# Altium project USB2TTL.PrjPCB
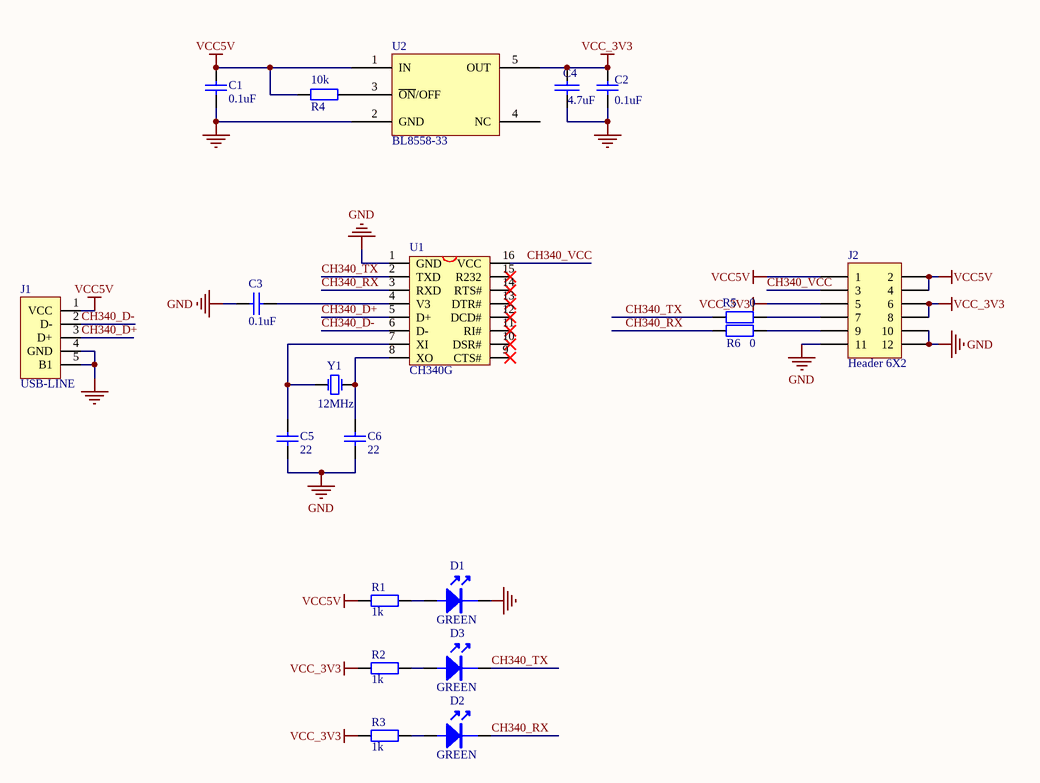
[diagram p0: Sheet1.SchDoc]
1 sheet, 20 parts. Net scope: global (net labels, ports and power ports of the same name join across sheets).
Board file: PCB2.PcbDoc

## Sheet Sheet1.SchDoc
size A4

### Parts
C1  0.1uF  [FT_0603 - C_3D]
C2  0.1uF  [FT_0603 - C_3D]
C3  0.1uF  [FT_0603 - C_3D]
C4  4.7uF  [FT_0805_C]
C5  22  [FT_0603 - C_3D]
C6  22  [FT_0603 - C_3D]
D1  GREEN  [FT_0603_D]
D2  GREEN  [FT_0603_D]
D3  GREEN  [FT_0603_D]
J1  USB-LINE  [FT_USBIF_Micro_BT_CB]
J2  Header 6X2  [HDR2X6]
R1  1k  [0603P]
R2  1k  [0603P]
R3  1k  [0603P]
R4  10k  [0603P]
R5  0  [0603P]
R6  0  [0603P]
U1  CH340G  [SOP16M]
U2  BL8558-33  [FT_SOT-23-5]
Y1  12MHz  [XTAL_US]

### Nets
GND: C1.1 C2.1 C3.2 C4.1 C5.2 C6.2 D1.2 J1.4(GND) J1.5(B1) J2.10 J2.11 J2.12 U1.1(GND) U2.2(GND)
VCC5V: C1.2 J1.1(VCC) J2.1 J2.2 J2.4 R1.1 R4.1 U2.1(IN)
VCC_3V3: C2.2 C4.2 J2.5 J2.6 J2.8 R2.1 R3.1 U2.5(OUT)
CH340_D+: J1.3(D+) U1.5(D+)
CH340_D-: J1.2(D-) U1.6(D-)
CH340_RX: D2.2 R6.1 U1.3(RXD)
CH340_TX: D3.2 R5.1 U1.2(TXD)
CH340_VCC: J2.3 U1.16(VCC)
NetC3_1: C3.1 U1.4(V3)
NetC5_1: C5.1 U1.7(XI) Y1.1(OSC1)
NetC6_1: C6.1 U1.8(XO) Y1.2(OSC2)
NetD1_1: D1.1 R1.2
NetD2_1: D2.1 R3.2
NetD3_1: D3.1 R2.2
NetJ2_7: J2.7 R5.2
NetJ2_9: J2.9 R6.2
NetR4_2: R4.2 U2.3(~{ON}/OFF)

Not connected (* = marked no-connect by the designer): U1 9(CTS#)* 10(DSR#)* 11(RI#)* 12(DCD#)* 13(DTR#)* 14(RTS#)* 15(R232)*; U2 4(NC)

### Library data of the parts
C1-C3 = GR: CAP CER .1UF 16V 10% X7R 0603; Part Number: GRM188R71C104KA01D; Manufacturer: Murata Electronics North America; Supplier 1: Digi-Key; Supplier Part Number 1: 490-1532-2-ND; Manufacturer Part Number: GRM188R71C104KA01D
C4 = CAP: Capacitor
C5 C6 = Cap: Capacitor; Published: 8-Jun-2000; LatestRevisionDate: 17-Jul-2002; LatestRevisionNote: Re-released for DXP Platform.; PackageReference: RAD-0.3; Publisher: Altium Limited
D1-D3 = LED
J2 = Header 6X2: Header, 6-Pin, Dual row; LatestRevisionDate: 17-Jul-2002; LatestRevisionNote: Re-released for DXP Platform.; Publisher: Altium Limited
R1-R6 = Resistor: RES 1.0M OHM 1/10W 5% 0603 SMD; Part Number: RC0603JR-071ML; Manufacturer: Yageo; Supplier 1: Digi-Key; Supplier Part Number 1: 311-1.0MGRDKR-ND; Manufacturer Part Number: RC0603JR-071ML
U1 = CH340G: USB2UART
U2 = LDO_5
Y1 = XTAL_2: Crystal Oscillator; Published: 8-Jun-2000; LatestRevisionDate: 17-Jul-2002; LatestRevisionNote: Re-released for DXP Platform.; Publisher: Altium Limited